# EAGLE design IceBoard-Rev3 (EAGLE 7.5.0)
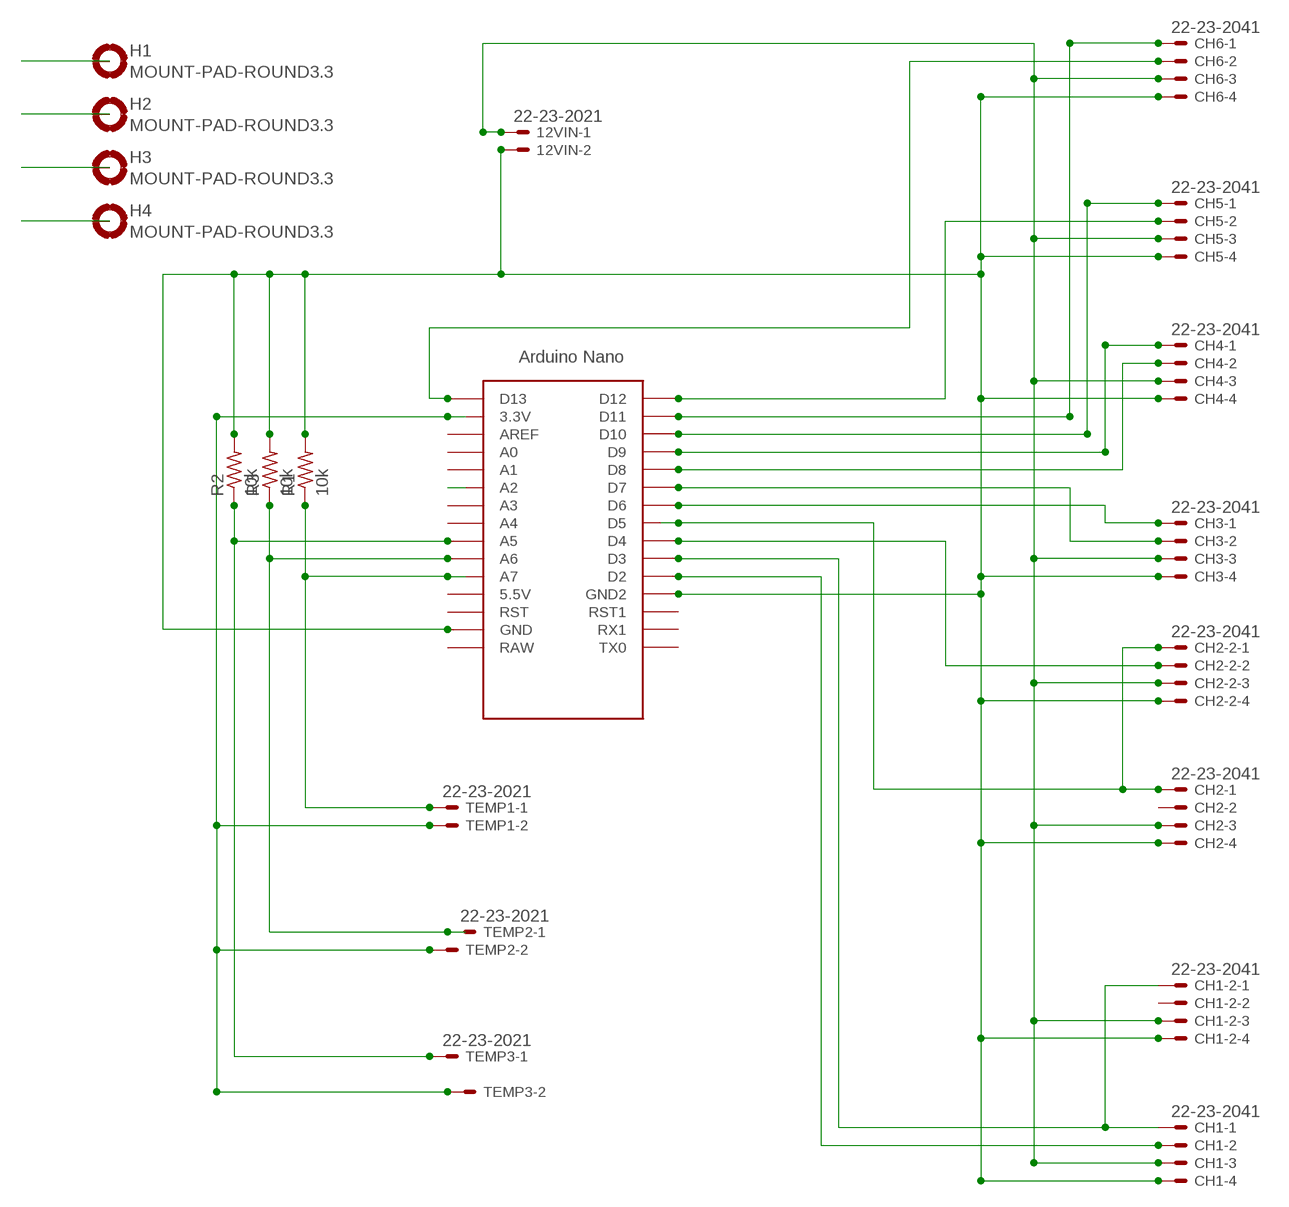
[diagram p0: schematic, sheet 1]

## Parts
12VIN  22-23-2021  [22-23-2021]
CH1  22-23-2041  [22-23-2041]
CH1-2  22-23-2041  [22-23-2041]
CH2  22-23-2041  [22-23-2041]
CH2-2  22-23-2041  [22-23-2041]
CH3  22-23-2041  [22-23-2041]
CH4  22-23-2041  [22-23-2041]
CH5  22-23-2041  [22-23-2041]
CH6  22-23-2041  [22-23-2041]
H1  MOUNT-PAD-ROUND3.3  [3,3-PAD]
H2  MOUNT-PAD-ROUND3.3  [3,3-PAD]
H3  MOUNT-PAD-ROUND3.3  [3,3-PAD]
H4  MOUNT-PAD-ROUND3.3  [3,3-PAD]
R1  10k  R-US_R0805  [R0805]
R2  10k  R-US_R0805  [R0805]
R3  10k  R-US_R0805  [R0805]
TEMP1  22-23-2021  [22-23-2021]
TEMP2  22-23-2021  [22-23-2021]
TEMP3  22-23-2021  [22-23-2021]
U$1  NANO  [NANO]

## Nets
10K: TEMP1.2 TEMP2.2 TEMP3.2 U$1.3.3V
GND: 12VIN.2 CH1-2.4 CH1.4 CH2-2.4 CH2.4 CH3.4 CH4.4 CH5.4 CH6.4 R1.2 R2.2 R3.2 U$1.GND U$1.GND1(GND2)
N$1: CH5.1 U$1.D10
N$2: CH6.1 U$1.D11
N$3: CH1-2.1 CH1.1 U$1.D3
N$4: CH2-2.1 CH2.1 U$1.D5
N$5: CH3.1 U$1.D6
N$6: CH4.1 U$1.D9
N$7: R3.1 TEMP2.1 U$1.A6
N$8: 12VIN.1 CH1-2.3 CH1.3 CH2-2.3 CH2.3 CH3.3 CH4.3 CH5.3 CH6.3
N$9: CH6.2 U$1.D13
N$10: CH5.2 U$1.D12
N$11: R1.1 TEMP1.1 U$1.A7
N$12: CH4.2 U$1.D8
N$13: CH3.2 U$1.D7
N$14: CH2-2.2 U$1.D4
N$15: CH1.2 U$1.D2
N$16: U$1.A2
N$18: R2.1 TEMP3.1 U$1.A5
Unconnected: CH1-2.2 CH2.2 H1.B3,3(MOUNT) H2.B3,3(MOUNT) H3.B3,3(MOUNT) H4.B3,3(MOUNT) U$1.5V(5.5V) U$1.A0 U$1.A1 U$1.A3 U$1.A4 U$1.AREF U$1.ICSP1 U$1.ICSP2 U$1.ICSP3 U$1.ICSP4 U$1.ICSP5 U$1.ICSP6 U$1.RAW U$1.RST U$1.RST1 U$1.RX1 U$1.TX0

## Library data of the parts
12VIN TEMP1-TEMP3 = con-molex:22-23-2021: .100" (2.54mm) Center Header - 2 Pin; MF: MOLEX; MPN: 22-23-2021; OC_FARNELL: 1462926; OC_NEWARK: 25C3832
CH1 CH1-2 CH2 CH2-2 CH3-CH6 = con-molex:22-23-2041: .100" (2.54mm) Center Header - 4 Pin; MF: MOLEX; MPN: 22-23-2041; OC_FARNELL: 1462920; OC_NEWARK: 38C0355
H1-H4 = holes:MOUNT-PAD-ROUND: MOUNTING PAD, round
R1-R3 = resistor:R-US_: RESISTOR, American symbol
U$1 = Arduino-clone:NANO: Arduino Nano

## Board
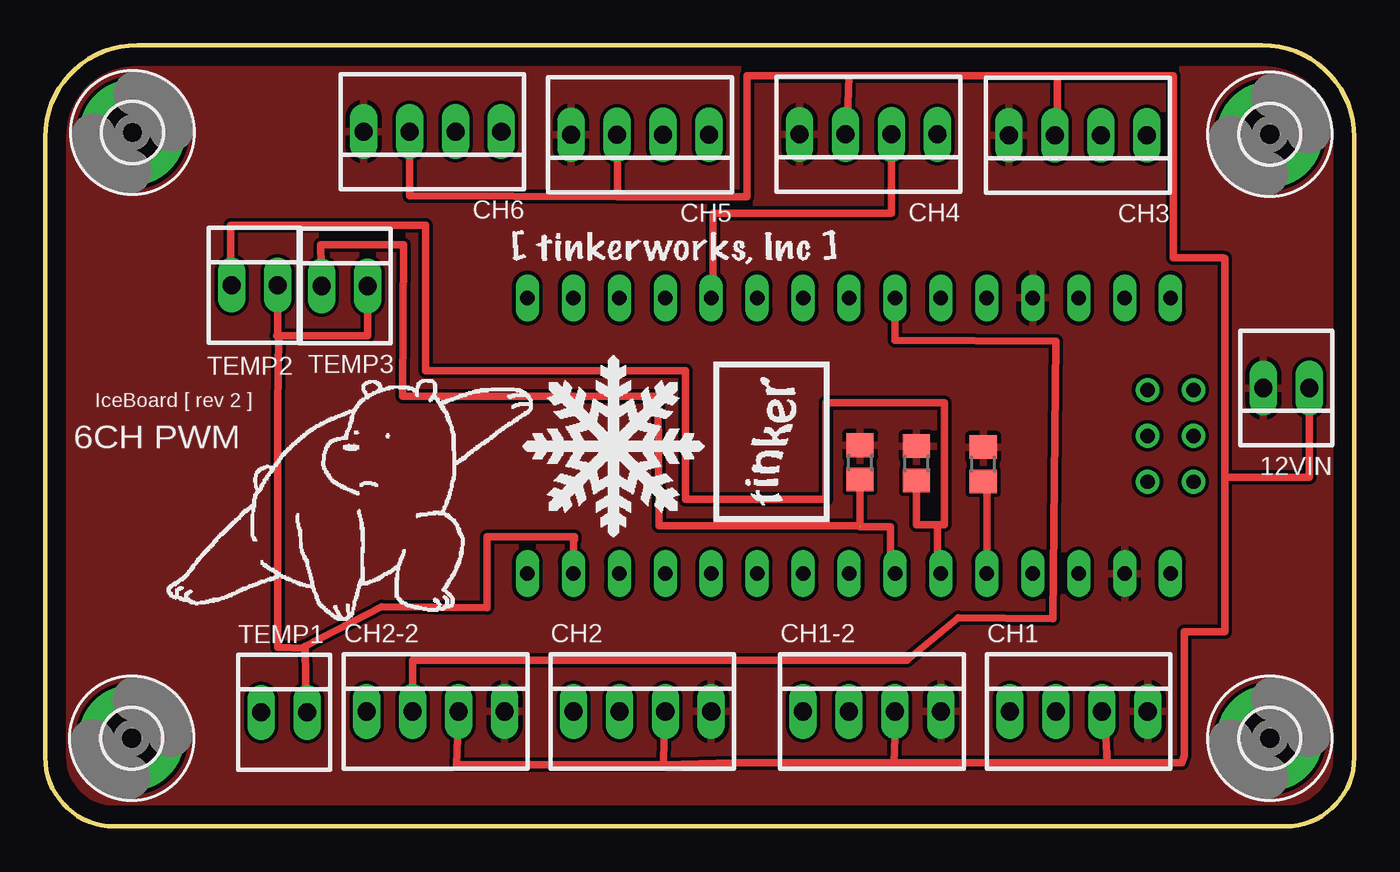
[diagram p1: board, top side]
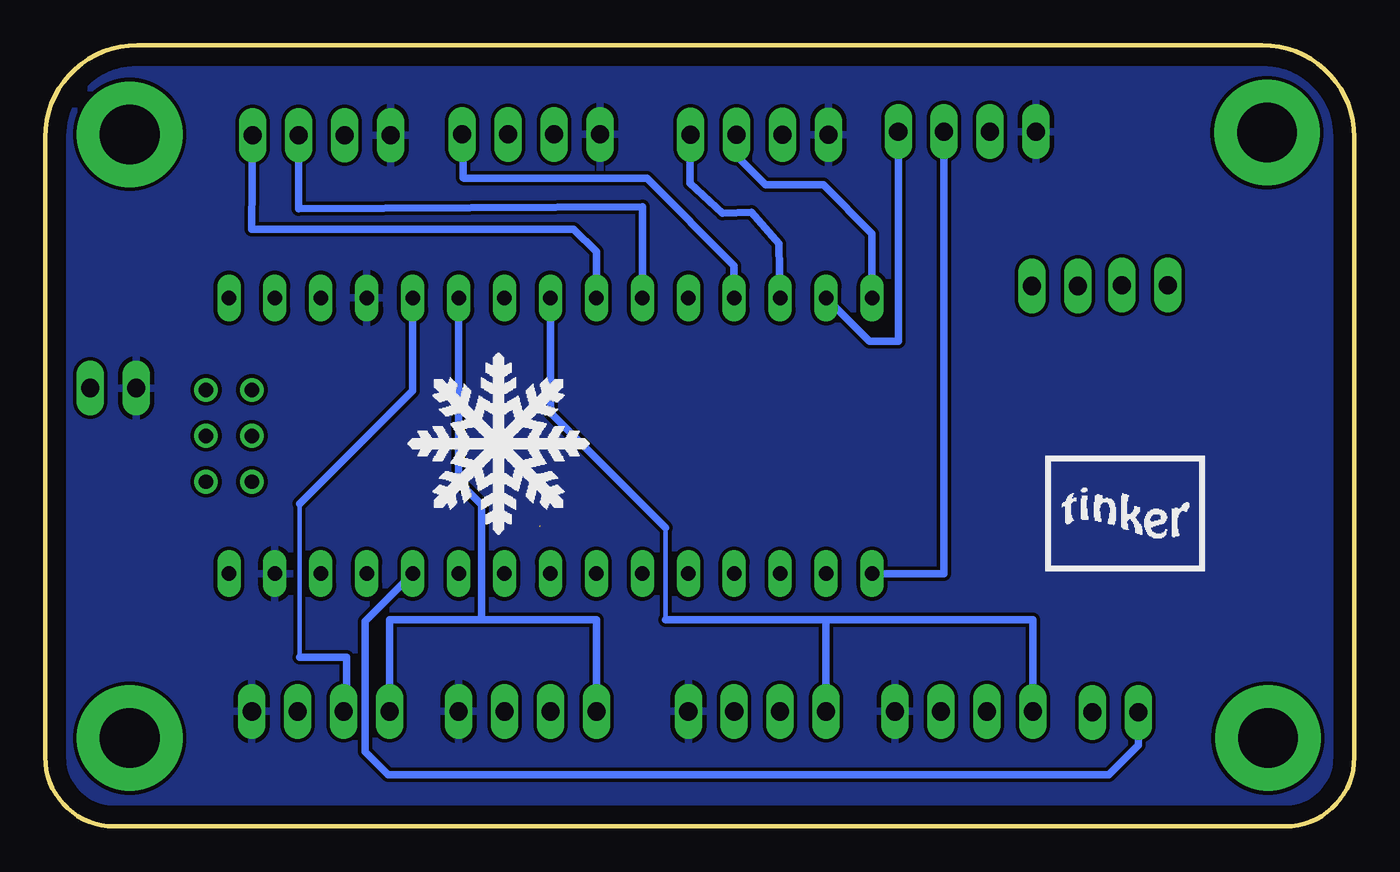
[diagram p2: board, bottom side, seen from below]

Size 72.39 x 43.18 mm. Coordinates in mm from the lower left corner, seen from the top.
Outline: 0,38.1 0,3.81 arc90 3.81,0 68.58,0 arc90 72.39,3.81 72.39,38.1 arc90 67.31,43.18 5.08,43.18 arc90 0,38.1
Copper layers (1*16): Top 0.035mm / dielectric 1.5mm / Bottom 0.035mm
Design rules "default": minimum track width 10mil, minimum drill 24mil, track to track 8mil, track to pad 8mil, pad to pad 8mil, via to via 8mil, smd to smd 8mil, copper to edge 40mil, drill to drill 8mil, minimum pad ring 10mil, minimum via ring 8mil, stop-mask expansion 4mil, vias tented up to drill 0mil, thermal gap 10mil

### Footprints (pad centres in the part's own frame; a part is rotated, then mirrored left to right if it is on the bottom)
22-23-2021 = drill 1 long: 1 -1.27,0; 2 1.27,0
22-23-2041 = drill 1 long: 1 -3.81,0; 2 -1.27,0; 3 1.27,0; 4 3.81,0
3,3-PAD = drill 3.3 pad 5.842: B3,3 0,0
R0805 = smd 1.3 x 1.5: 1 -0.95,0; 2 0.95,0
NANO = drill 0.8 long: 3.3V -10.16,24.13; 5V -10.16,-1.27; A0 -10.16,19.05; A1 -10.16,16.51; A2 -10.16,13.97; A3 -10.16,11.43; A4 -10.16,8.89; A5 -10.16,6.35; A6 -10.16,3.81; A7 -10.16,1.27; AREF -10.16,21.59; D2 5.08,1.27; D3 5.08,3.81; D4 5.08,6.35; D5 5.08,8.89; D6 5.08,11.43; D7 5.08,13.97; D8 5.08,16.51; D9 5.08,19.05; D10 5.08,21.59; D11 5.08,24.13; D12 5.08,26.67; D13 -10.16,26.67; GND -10.16,-6.35; GND1 5.08,-1.27; RAW -10.16,-8.89; RST -10.16,-3.81; RST1 5.08,-3.81; RX1 5.08,-6.35; TX0 5.08,-8.89 | drill 0.8: ICSP1 -5.08,-10.16; ICSP2 -5.08,-7.62; ICSP3 -2.54,-10.16; ICSP4 -2.54,-7.62; ICSP5 0,-10.16; ICSP6 0,-7.62

### Placement (x,y rotation side)
12VIN  68.63,24.23 180 top
CH1  57.15,6.35 0 top
CH1-2  45.72,6.35 0 top
CH2  33.02,6.35 0 top
CH2-2  21.59,6.35 0 top
CH3  57.1,38.2 180 top
CH4  45.52,38.25 180 top
CH5  32.89,38.23 180 top
CH6  21.41,38.4 180 top
H1  4.83,38.35 0 top
H2  67.72,38.25 0 top
H3  4.78,4.88 0 top
H4  67.72,4.88 0 top
R1  51.87,20.02 90 top
R2  45.06,20.12 90 top
R3  48.18,20.07 90 top
TEMP1  13.21,6.3 0 top
TEMP2  11.58,29.92 0 top
TEMP3  16.56,29.87 0 top
U$1  53.34,24.13 90 top

### Tracks (layer width: path | path; a pad name or v marks a point on that pad's centre or on a via)
10K
  Top 0.406: TEMP1.2 14.43,6.35 14.38,9.96 | 14.38,9.96 18.59,12.14 24.43,12.09 24.43,16 29.26,16 29.26,15.85 29.21,15.85 U$1.3.3V | 12.9,27.13 12.8,27.13 12.85,27.18 TEMP2.2 | TEMP3.2 17.83,27.13 12.9,27.13 | 12.9,27.13 12.85,23.17 12.85,9.91 14.38,9.86 14.38,9.96
GND
  Top 0.254: 59.64,13.92 U$1.GND
  pour Bottom: 0.05,38.02 arc-90 5.16,43.13 67.21,43.13 arc-90 72.42,37.92 72.42,3.91 arc-90 68.45,-0.05 3.71,-0.05 arc-90 0,3.66 0.05,32.41
  pour Top: -0.05,37.34 arc-90 5.79,43.18 7.37,43.18 arc90 7.42,43.13 67.41,43.13 arc-90 72.39,38.15 72.39,3.15 arc-90 69.19,-0.05 3.66,-0.05 arc-90 0.05,3.56
N$1
  Bottom 0.406: CH5.1 36.73,38.2 36.73,35.56 34.95,33.88 33.32,33.93 31.8,32.21 U$1.D10
N$2
  Bottom 0.406: CH6.1 25.2,31.75 25.2,26.82 26.82,26.82 U$1.D11
N$3
  Bottom 0.406: CH1-2.1 41.91,11.43 48.26,11.43 | CH1.1 53.34,11.43 48.26,11.43 | U$1.D3 49.53,19.05 48.26,17.78 48.26,11.43
N$4
  Bottom 0.254: 38.1,16.51 38.1,11.43
  Bottom 0.406: U$1.D5 44.45,22.86 38.1,16.51 | 38.1,11.43 29.21,11.43 | 29.21,11.43 17.78,11.43 CH2-2.1 | CH2.1 29.21,11.43
N$5
  Bottom 0.406: U$1.D6 41.91,31.75 43.18,33.02 60.96,33.02 CH3.1
N$6
  Bottom 0.406: 49.53,38.1 CH4.1 49.28,38.2 49.28,35.87 49.22,35.81 39.12,35.81 34.29,30.99 U$1.D9
N$7
  Top 0.406: 49.33,16.66 49.73,16.66 49.73,23.42 43.18,23.42 43.18,18.09 35.41,18.09 35.41,25.2 21.03,25.2 21.03,33.22 10.26,33.22 10.26,29.92 TEMP2.1 | 49.33,16.66 49.33,13.97 U$1.A6 | R3.1 48.18,16.66 49.33,16.66
N$8
  Top 0.406: 58.72,3.51 62.84,3.51 62.99,3.91 62.99,10.77 65.23,10.77 65.23,19.3 | 58.72,3.51 46.94,3.51 | 46.94,3.51 38.05,3.51 34.19,3.4 | 34.19,3.4 22.76,3.4 CH2-2.3 | CH2.3 34.24,6.35 34.19,3.4 | CH1.3 58.57,6.35 58.72,3.51 | CH1-2.3 47.04,6.35 46.94,3.51 | 55.98,41.5 62.38,41.5 62.38,31.45 65.13,31.45 65.13,31.39 65.23,31.39 65.23,19.3 | 55.98,41.5 44.45,41.5 | 44.45,41.5 38.81,41.5 38.81,34.8 31.65,34.8 | 31.65,34.8 20.14,34.85 CH6.3 | CH4.3 44.35,38.25 44.45,41.5 | CH3.3 55.98,38.2 55.98,41.5 | CH5.3 31.65,38.23 31.65,34.8 | 12VIN.1 69.9,19.3 65.23,19.3
N$9
  Bottom 0.406: U$1.D13 22.68,13.97 CH6.2
N$10
  Bottom 0.406: 26.72,29.26 U$1.D12 26.67,32.77 29.36,35.46 32.56,35.46 34.16,37.06 CH5.2
N$11
  Top 0.406: 51.99,14.05 U$1.A7 52.07,18.86 R1.1
  Bottom 0.406: TEMP1.1 11.94,4.47 13.56,2.85 53.44,2.85 54.71,4.12 54.71,11.33 U$1.A7
N$12
  Top 0.406: CH4.2 46.79,33.88 36.93,33.88 36.93,29.21 U$1.D8
N$13
  Bottom 0.406: CH3.2 58.37,34.14 39.37,34.24 U$1.D7
N$14
  Top 0.406: 20.42,6.35 CH2-2.2 20.32,9.2 47.65,9.2 50.49,11.53 55.73,11.48 55.88,26.82 46.99,26.87 U$1.D4
N$15
  Bottom 0.254: 58.32,9.35 58.32,17.83
  Bottom 0.406: U$1.D2 52.07,24.08 58.32,17.83 | 58.32,9.35 55.73,9.35 55.73,6.5 CH1.2
N$18  (1 unrouted)
  Top 0.406: TEMP3.1 15.24,32.16 19.81,32.16 19.76,23.77 33.88,23.77 33.93,16.61 45.06,16.61 R2.1 | U$1.A5 46.74,13.97 46.74,16.05 46.74,16.56 45.06,16.56

### Text on the board
tPlace: IceBoard [ rev 2 ] | 6CH PWM